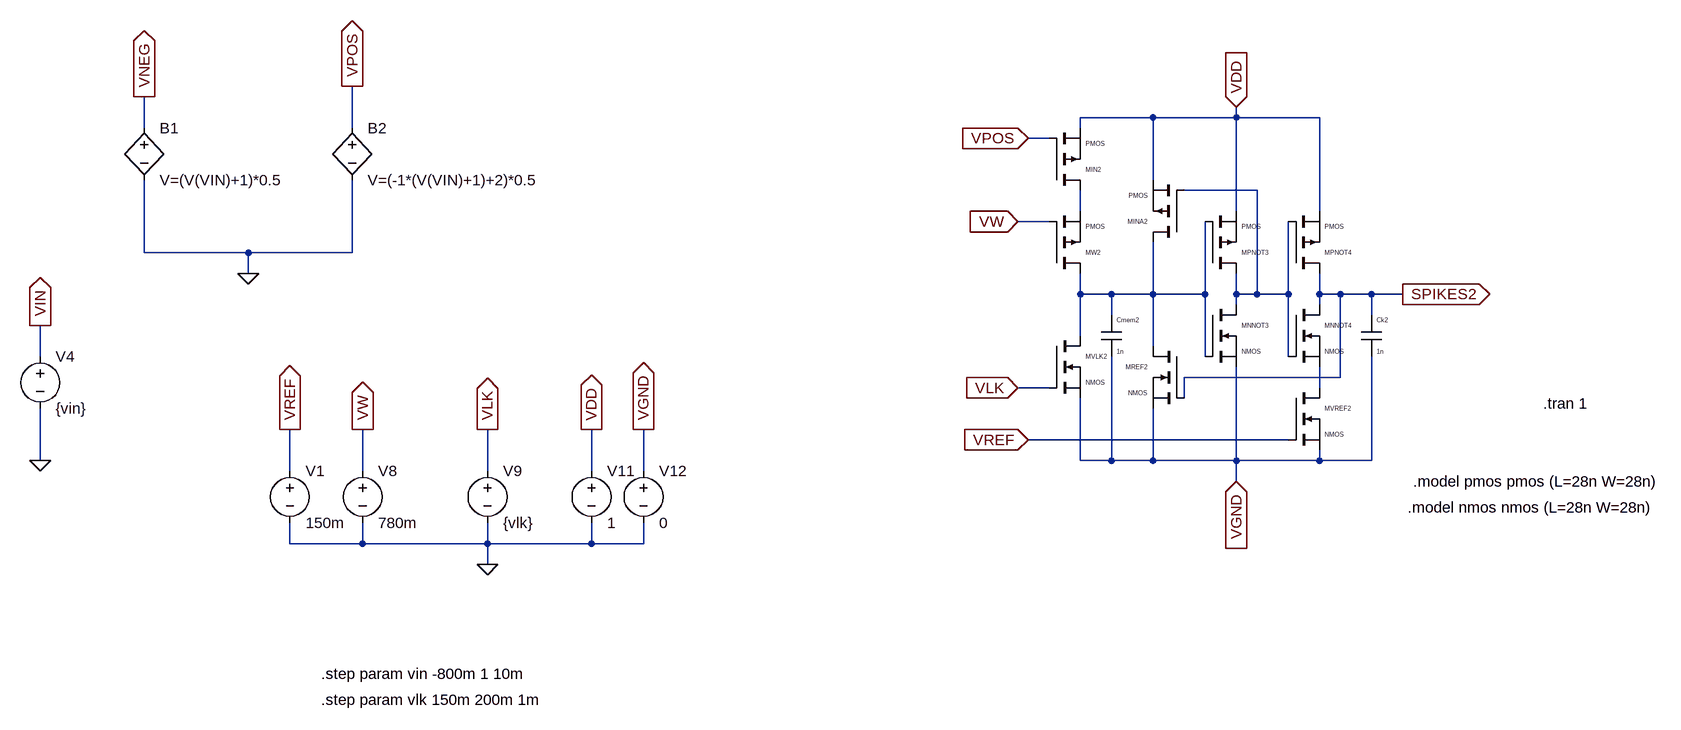
[diagram p0: schematic swep2.asc]
swep2.asc, the LTspice schematic file:
Version 4
SHEET 1 9016 8100
WIRE 2016 1776 1904 1776
WIRE 2144 1776 2144 1760
WIRE 2144 1776 2016 1776
WIRE 2272 1776 2144 1776
WIRE 464 1792 464 1744
WIRE 784 1792 784 1728
WIRE 1904 1792 1904 1776
WIRE 1856 1808 1824 1808
WIRE 2016 1872 2016 1776
WIRE 2176 1888 2064 1888
WIRE 1904 1920 1904 1888
WIRE 2144 1920 2144 1776
WIRE 2272 1920 2272 1776
WIRE 1856 1936 1808 1936
WIRE 464 1984 464 1872
WIRE 624 1984 464 1984
WIRE 784 1984 784 1872
WIRE 784 1984 624 1984
WIRE 624 2016 624 1984
WIRE 1904 2048 1904 2016
WIRE 1952 2048 1904 2048
WIRE 2016 2048 2016 1968
WIRE 2016 2048 1952 2048
WIRE 2096 2048 2096 1936
WIRE 2096 2048 2016 2048
WIRE 2144 2048 2144 2016
WIRE 2176 2048 2176 1888
WIRE 2176 2048 2144 2048
WIRE 2224 2048 2224 1936
WIRE 2224 2048 2176 2048
WIRE 2272 2048 2272 2016
WIRE 2304 2048 2272 2048
WIRE 2352 2048 2304 2048
WIRE 2400 2048 2352 2048
WIRE 2144 2064 2144 2048
WIRE 2272 2064 2272 2048
WIRE 1952 2080 1952 2048
WIRE 2352 2080 2352 2048
WIRE 1904 2112 1904 2048
WIRE 2016 2128 2016 2048
WIRE 304 2144 304 2096
WIRE 2096 2144 2096 2048
WIRE 2224 2144 2224 2048
WIRE 2304 2176 2304 2048
WIRE 2304 2176 2064 2176
WIRE 1856 2192 1808 2192
WIRE 2272 2192 2272 2160
WIRE 2064 2208 2064 2176
WIRE 2224 2272 1824 2272
WIRE 304 2304 304 2224
WIRE 1904 2304 1904 2208
WIRE 1952 2304 1952 2144
WIRE 1952 2304 1904 2304
WIRE 2016 2304 2016 2224
WIRE 2016 2304 1952 2304
WIRE 2144 2304 2144 2160
WIRE 2144 2304 2016 2304
WIRE 2272 2304 2272 2288
WIRE 2272 2304 2144 2304
WIRE 2352 2304 2352 2144
WIRE 2352 2304 2272 2304
WIRE 688 2320 688 2256
WIRE 800 2320 800 2256
WIRE 992 2320 992 2256
WIRE 1152 2320 1152 2256
WIRE 1232 2320 1232 2256
WIRE 2144 2336 2144 2304
WIRE 688 2432 688 2400
WIRE 800 2432 800 2400
WIRE 800 2432 688 2432
WIRE 992 2432 992 2400
WIRE 992 2432 800 2432
WIRE 1152 2432 1152 2400
WIRE 1152 2432 992 2432
WIRE 1232 2432 1232 2400
WIRE 1232 2432 1152 2432
WIRE 992 2464 992 2432
FLAG 992 2464 0
FLAG 800 2256 VW
IOPIN 800 2256 Out
FLAG 992 2256 VLK
IOPIN 992 2256 Out
FLAG 1152 2256 VDD
IOPIN 1152 2256 Out
FLAG 1232 2256 VGND
IOPIN 1232 2256 Out
FLAG 2144 1760 VDD
IOPIN 2144 1760 In
FLAG 1808 1936 VW
IOPIN 1808 1936 In
FLAG 1808 2192 VLK
IOPIN 1808 2192 In
FLAG 1824 2272 VREF
IOPIN 1824 2272 In
FLAG 2144 2336 VGND
IOPIN 2144 2336 In
FLAG 2400 2048 SPIKES2
IOPIN 2400 2048 Out
FLAG 304 2304 0
FLAG 688 2256 VREF
IOPIN 688 2256 Out
FLAG 304 2096 VIN
IOPIN 304 2096 Out
FLAG 624 2016 0
FLAG 464 1744 VNEG
IOPIN 464 1744 Out
FLAG 784 1728 VPOS
IOPIN 784 1728 Out
FLAG 1824 1808 VPOS
IOPIN 1824 1808 In
SYMBOL voltage 800 2304 R0
WINDOW 123 0 0 Left 0
WINDOW 39 0 0 Left 0
SYMATTR InstName V8
SYMATTR Value 780m
SYMBOL voltage 992 2304 R0
WINDOW 123 0 0 Left 0
WINDOW 39 0 0 Left 0
SYMATTR InstName V9
SYMATTR Value {vlk}
SYMBOL voltage 1152 2304 R0
WINDOW 123 0 0 Left 0
WINDOW 39 0 0 Left 0
SYMATTR InstName V11
SYMATTR Value 1
SYMBOL voltage 1232 2304 R0
WINDOW 123 0 0 Left 0
WINDOW 39 0 0 Left 0
SYMATTR InstName V12
SYMATTR Value 0
SYMBOL pmos 1856 2016 M180
WINDOW 0 56 32 Left 0
WINDOW 3 56 72 Left 0
SYMATTR InstName MW2
SYMATTR SpiceLine L=28n W=28n
SYMBOL cap 1936 2080 R0
WINDOW 0 24 8 Left 0
WINDOW 3 24 56 Left 0
SYMATTR InstName Cmem2
SYMATTR Value 1n
SYMATTR SpiceLine V=4 Irms=162m Rser=0.395426 Lser=0
SYMBOL cap 2336 2080 R0
WINDOW 0 24 8 Left 0
WINDOW 3 24 56 Left 0
SYMATTR InstName Ck2
SYMATTR Value 1n
SYMBOL pmos 2096 2016 M180
WINDOW 0 56 32 Left 0
WINDOW 3 56 72 Left 0
SYMATTR InstName MPNOT3
SYMBOL nmos 2096 2064 R0
WINDOW 0 56 32 Left 0
WINDOW 3 56 72 Left 0
SYMATTR InstName MNNOT3
SYMBOL nmos 2224 2192 R0
WINDOW 0 56 32 Left 0
WINDOW 3 56 72 Left 0
SYMATTR InstName MVREF2
SYMBOL nmos 2064 2128 M0
WINDOW 0 56 32 Left 0
WINDOW 3 56 72 Left 0
SYMATTR InstName MREF2
SYMBOL nmos 1856 2112 R0
WINDOW 0 56 32 Left 0
WINDOW 3 56 72 Left 0
SYMATTR InstName MVLK2
SYMBOL pmos 2064 1968 R180
WINDOW 0 56 32 Left 0
WINDOW 3 56 72 Left 0
SYMATTR InstName MINA2
SYMBOL pmos 1856 1888 M180
WINDOW 0 56 32 Left 0
WINDOW 3 56 72 Left 0
SYMATTR InstName MIN2
SYMBOL pmos 2224 2016 M180
WINDOW 0 56 32 Left 0
WINDOW 3 56 72 Left 0
SYMATTR InstName MPNOT4
SYMBOL nmos 2224 2064 R0
WINDOW 0 56 32 Left 0
WINDOW 3 56 72 Left 0
SYMATTR InstName MNNOT4
SYMBOL voltage 304 2128 R0
WINDOW 123 0 0 Left 0
WINDOW 39 0 0 Left 0
SYMATTR InstName V4
SYMATTR Value {vin}
SYMBOL voltage 688 2304 R0
WINDOW 123 0 0 Left 0
WINDOW 39 0 0 Left 0
SYMATTR InstName V1
SYMATTR Value 150m
SYMBOL bv 464 1776 R0
SYMATTR InstName B1
SYMATTR Value V=(V(VIN)+1)*0.5
SYMBOL bv 784 1776 R0
SYMATTR InstName B2
SYMATTR Value V=(-1*(V(VIN)+1)+2)*0.5
TEXT 2616 2216 Left 2 !.tran 1
TEXT 2408 2376 Left 2 !.model nmos nmos (L=28n W=28n)
TEXT 2416 2336 Left 2 !.model pmos pmos (L=28n W=28n)
TEXT 736 2632 Left 2 !.step param vin -800m 1 10m
TEXT 736 2672 Left 2 !.step param vlk 150m 200m 1m

The netlist it stands for:
* swep2.asc
V8 VW 0 780m
V9 VLK 0 {vlk}
V11 VDD 0 1
V12 VGND 0 0
MW2 N003 VW N002 N002 PMOS L=28n W=28n
Cmem2 N003 VGND 1n V=4 Irms=162m Rser=0.395426 Lser=0
Ck2 SPIKES2 VGND 1n
MPNOT3 N001 N003 VDD VDD PMOS
MNNOT3 N001 N003 VGND VGND NMOS
MVREF2 N004 VREF VGND VGND NMOS
MREF2 N003 SPIKES2 VGND VGND NMOS
MVLK2 N003 VLK VGND VGND NMOS
MINA2 N003 N001 VDD VDD PMOS
MIN2 N002 VPOS VDD VDD PMOS
MPNOT4 SPIKES2 N001 VDD VDD PMOS
MNNOT4 SPIKES2 N001 N004 N004 NMOS
V4 VIN 0 {vin}
V1 VREF 0 150m
B1 VNEG 0 V=(V(VIN)+1)*0.5
B2 VPOS 0 V=(-1*(V(VIN)+1)+2)*0.5
.model NMOS NMOS
.model PMOS PMOS
.lib standard.mos
.tran 1
.model nmos nmos (L=28n W=28n)
.model pmos pmos (L=28n W=28n)
.step param vin -800m 1 10m
.step param vlk 150m 200m 1m
.backanno
.end